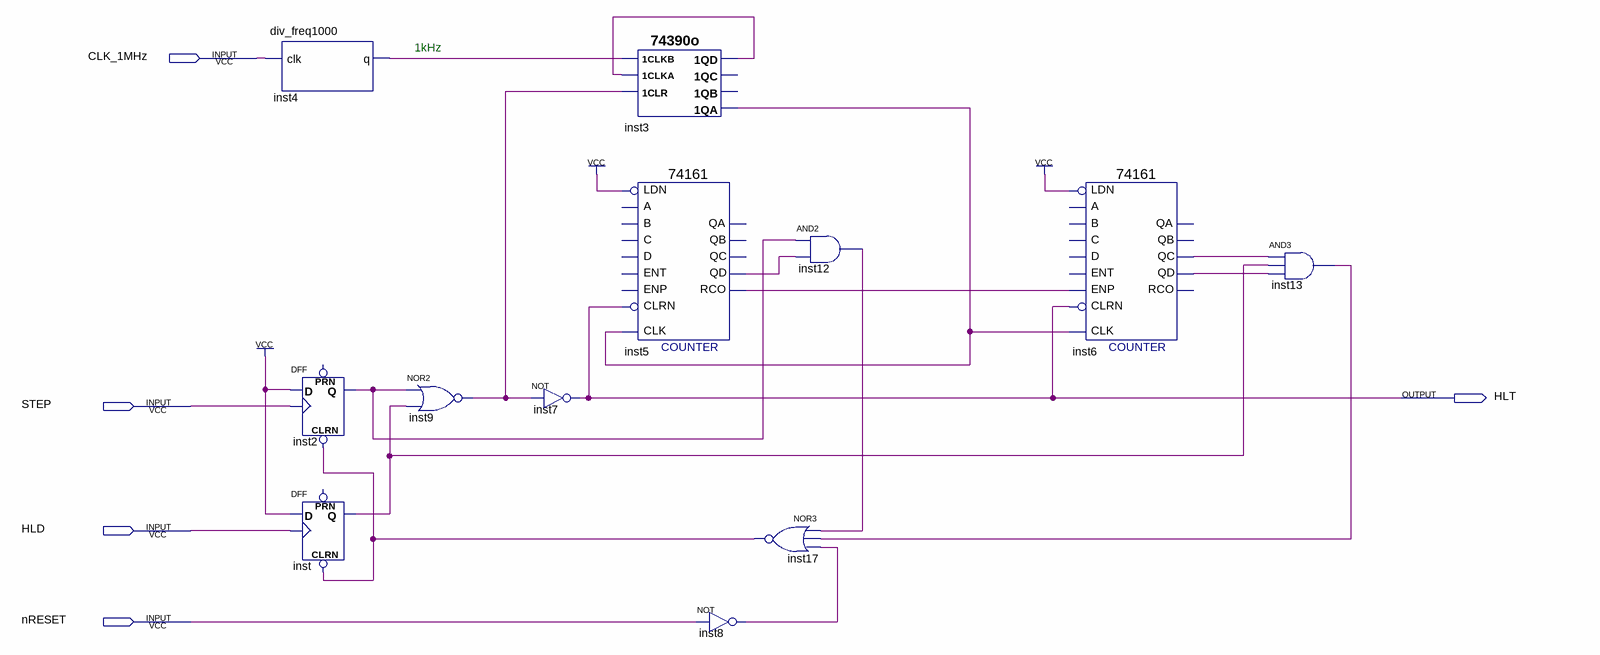
[diagram p0: schematic sheet]
// Quartus schematic Timer.bdf as structural Verilog: 12 symbols, 5 pins
module Timer (
  input  CLK_1MHz,
  input  STEP,
  input  HLD,
  input  nRESET,
  output HLT
);

  wire inst2_q, inst3_1qa, inst3_1qd, inst4_q, inst5_qd, inst5_rco, inst6_qc, inst6_qd, inst8_out, inst9_out,
       inst12_out, inst13_out, inst17_out, inst_q;

  div_freq1000 inst4 (.clk(CLK_1MHz), .q(inst4_q));
  DFF inst2 (.CLRN(inst17_out), .CLK(STEP), .D(1'b1), .Q(inst2_q));  // open: PRN
  DFF inst (.CLRN(inst17_out), .CLK(HLD), .D(1'b1), .Q(inst_q));  // open: PRN
  nor inst9 (inst9_out, inst2_q, inst_q);
  not inst7 (HLT, inst9_out);
  \74390o  inst3 (
    .\1CLKB (inst4_q), .\1CLKA (inst3_1qd), .\1CLR (inst9_out), .\1QD (inst3_1qd), .\1QA (inst3_1qa));  // open: 1QC, 1QB
  \74161  inst5 (
    .CLRN(HLT), .CLK(inst3_1qa), .LDN(1'b1), .QD(inst5_qd), .RCO(inst5_rco));  // open: ENP, A, D, ENT, B, C, QC, QB, QA
  not inst8 (inst8_out, nRESET);
  nor inst17 (inst17_out, inst12_out, inst13_out, inst8_out);
  and inst12 (inst12_out, inst2_q, inst5_qd);
  \74161  inst6 (
    .CLRN(HLT), .CLK(inst3_1qa), .ENP(inst5_rco), .LDN(1'b1), .QD(inst6_qd), .QC(inst6_qc));  // open: A, D, ENT, B, C, QB, QA, RCO
  and inst13 (inst13_out, inst6_qc, inst_q, inst6_qd);

  // Notes on the sheet:
  //   1kHz
endmodule
